# Altium schematic sheet SENSORS.SchDoc
size A
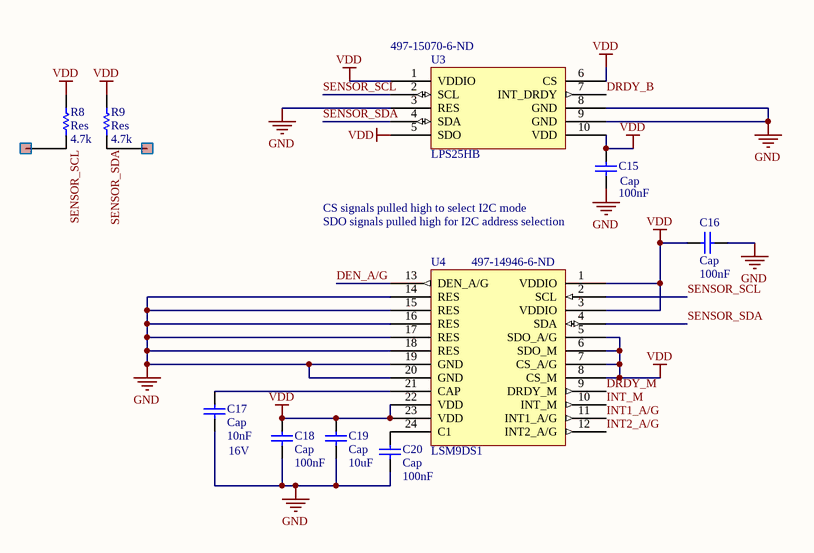
[diagram p0: SENSORS.SchDoc]

## Parts
C15  Cap  value 100nF  [C0805]
C16  Cap  value 100nF  [C0805]
C17  Cap  value 10nF  Rating: 16V  [C0805]
C18  Cap  value 100nF  [C0805]
C19  Cap  value 10uF  [C0805]
C20  Cap  value 100nF  [C0805]
R8  Res  value 4.7k  [3216[1206]]
R9  Res  value 4.7k  [3216[1206]]
TPS1  Test_point_SMD  [TEST_POINT_SMD]  (value not drawn)
TPS2  Test_point_SMD  [TEST_POINT_SMD]  (value not drawn)
U3  LPS25HB  Supplier Part Number 1: 497-15070-6-ND  [HLGA-10L - narrow]
U4  LSM9DS1  Supplier Part Number 1: 497-14946-6-ND  [LGA-24 - NARROW - Long Pads]

## Nets
GND: C15.1 C16.2 C17.2 C18.2 C19.2 C20.1 U3.3(RES) U3.8(GND) U3.9(GND) U4.14(RES) U4.15(RES) U4.16(RES) U4.17(RES) U4.18(RES) U4.19(GND) U4.20(GND)
VDD: C15.2 C16.1 C18.1 C19.1 R8.1 R9.1 U3.1(VDDIO) U3.5(SDO) U3.6(CS) U3.10(VDD) U4.1(VDDIO) U4.3(VDDIO) U4.5(SDO_A/G) U4.6(SDO_M) U4.7(CS_A/G) U4.8(CS_M) U4.22(VDD) U4.23(VDD)
DEN_A/G: U4.13(DEN_A/G)
DRDY_B: U3.7(INT_DRDY)
DRDY_M: U4.9(DRDY_M)
INT1_A/G: U4.11(INT1_A/G)
INT2_A/G: U4.12(INT2_A/G)
INT_M: U4.10(INT_M)
SENSOR_SCL: R8.2 TPS1.1 U3.2(SCL) U4.2(SCL)
SENSOR_SDA: R9.2 TPS2.1 U3.4(SDA) U4.4(SDA)
NetC17_1: C17.1 U4.21(CAP)
NetC20_2: C20.2 U4.24(C1)

## Notes on the sheet
- CS signals pulled high to select I2C mode
- SDO signals pulled high for I2C address selection

## Library data of the parts
C15-C20 = Cap: Capacitor; Published: 8-Jun-2000; LatestRevisionDate: 17-Jul-2002; LatestRevisionNote: Re-released for DXP Platform.; PackageReference: C1206; Publisher: Altium Limited
R8 R9 = Res: Surface Mount Resistor; Published: 8-Jun-2000; LatestRevisionDate: 17-Jul-2002; LatestRevisionNote: Re-released for DXP Platform.; PackageReference: AXIAL-0.5; Publisher: Altium Limited
TPS1 TPS2 = Test_point_SMD: Test Point SMD
U3 = LPS25HB: Manufacturer: STMicroelectronics; Manufacturer Part Number: LPS25HBTR; Operating Pressure: 18.27; Port Style: No Port; Max Pressure: 290.08; Min Supply Voltage: 1.7; Max Supply Voltage: 3.6; Supplier 1: Digikey; Stock 1: 0; Pricing 1: 1=3.25, 10=2.917, 100=2.3901 (USD); Mount: Surface Mount; Number of Pins: 10; Contact Plating: Nickel,Gold; Min Operating Temperature: -30; Max Operating Temperature: 105; Termination: Solder; REACH SVHC: No SVHC; Lead Free: Lead Free; ComponentLink1URL: http://www.farnell.com/datasheets/1992925.pdf; ComponentLink1Description: http://www.farnell.com/datasheets/1992925.pdf; ComponentLink2URL: http://www.st.com/st-web-ui/static/active/en/resource/technical/document/datasheet/DM00141379.pdf; ComponentLink2Description: http://www.st.com/st-web-ui/static/active/en/resource/technical/document/datasheet/DM00141379.pdf
U4 = LSM9DS1: Manufacturer: STMicroelectronics; Manufacturer Part Number: LSM9DS1TR; Min Supply Voltage: 1.9; Max Supply Voltage: 3.6; Supplier 1: Digikey; Stock 1: 6141; Pricing 1: 1=6.4, 10=5.751, 100=4.7119 (USD); Case/Package: LGA; Number of Pins: 24; Min Operating Temperature: -40; Max Operating Temperature: 85; Packaging: Cut Tape; REACH SVHC: No SVHC; Lead Free: Lead Free; ComponentLink1URL: http://www.farnell.com/datasheets/2028150.pdf; ComponentLink1Description: http://www.farnell.com/datasheets/2028150.pdf